# Altium schematic sheet Superbot_USB.SchDoc
size A4
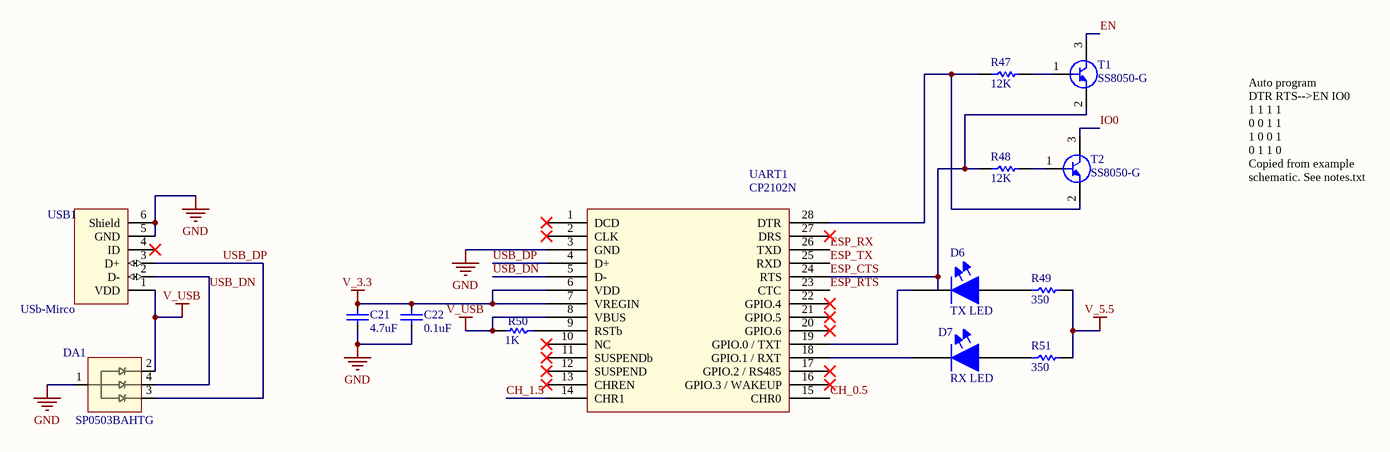
[diagram p0: Superbot_USB.SchDoc]

## Parts
C21  4.7uF  [CAP0603R]
C22  0.1uF  [CAP0603R]
D6  TX LED  [0603_LED]
D7  RX LED  [0603_LED]
DA1  SP0503BAHTG  [SOT143_SP0503BAHT]
R47  12K  [RES0603R]
R48  12K  [RES0603R]
R49  350  [RES0603R]
R50  1K  [RES0603R]
R51  350  [RES0603R]
T1  SS8050-G  [SOT23-SS8050-G]
T2  SS8050-G  [SOT23-SS8050-G]
UART1  CP2102N  [QFN28_CP2102n]
USB1  USb-Mirco  [USB_micro_through]

## Nets
GND: C21.2 C22.2 DA1.1(GND) UART1.3(GND) USB1.5(GND) USB1.6(Shield)
V_3.3: C21.1 C22.1 UART1.6(VDD) UART1.7(VREGIN)
V_5.5: R49.2 R51.2
V_USB: DA1.2(A) R50.2 UART1.8(VBUS) USB1.1(VDD)
CH_0.5: UART1.15(CHR0)
CH_1.5: UART1.14(CHR1)
EN: T1.3(CLCTR)
ESP_CTS: R48.1 T1.2(EMTTR) UART1.24(RTS)
ESP_RTS: UART1.23(CTC)
ESP_RX: UART1.26(TXD)
ESP_TX: UART1.25(RXD)
IO0: T2.3(CLCTR)
USB_DN: DA1.4(C) UART1.5(D-) USB1.2(D-)
USB_DP: DA1.3(B) UART1.4(D+) USB1.3(D+)
NetD6_A: D6.A(ANODE) R49.1
NetD6_K: D6.K(CATHODE) UART1.19(GPIO.0_/_TXT)
NetD7_A: D7.A(ANODE) R51.1
NetD7_K: D7.K(CATHODE) UART1.18(GPIO.1_/_RXT)
NetR47_1: R47.1 T2.2(EMTTR) UART1.28(DTR)
NetR47_2: R47.2 T1.1(BASE)
NetR48_2: R48.2 T2.1(BASE)
NetR50_1: R50.1 UART1.9(RSTb)

Not connected (* = marked no-connect by the designer): UART1 1(DCD)* 2(CLK)* 10(NC)* 11(SUSPENDb)* 12(SUSPEND)* 13(CHREN)* 16(GPIO.3_/_WAKEUP)* 17(GPIO.2_/_RS485)* 20(GPIO.6)* 21(GPIO.5)* 22(GPIO.4)* 27(DRS)*; USB1 4(ID)*

## Notes on the sheet
- Auto program
  DTR RTS-->EN IO0
  1 1 1 1
  0 0 1 1
  1 0 0 1
  0 1 1 0
  Copied from example schematic. See notes.txt

## Library data of the parts
C21 C22 = C: Capacitor; Manufacturer: Microchip Technology; Manufacturer Part Num: MIC5378YC5-TR; Class I: Passive; Revision: July-2002: Re-released for DXP Platform.; Supplier 1: Digikey; Supplier Part Number 1: *; Supplier Part Number 1: 1611-MIC5378YC5-CT-ND
  C21: Value: 4.7uF
  C22: Value: 0.1uF
D6 D7 = LED: Color: RED; Supplier 1: Digikey
DA1 = SP0503BAHTG: TVS DIODE 5.5VWM 8.5VC SOT143; Manufacturer: Littelfuse; Value: *; Manufacturer Part Num: SP0503BAHTG; Supplier 1: Digikey; Supplier Part Number 1: F2715CT-ND
R47-R51 = R: Resistor; Supplier 1: Digikey; Supplier Part Number 1: *
  R47 R48: Value: 12K
  R49 R51: Value: 350
  R50: Value: 1K
T1 T2 = NPN Transistor
UART1 = CP2102N: 336-3694-ND / , IC BRIDGE USB TO UART 28QFN
USB1 = USb-Mirco: USb-Mirco, CONN RCPT MCR USB B SMD TH SHLL; Manufacturer Part Num: ZX62D-B-5P8; Manufacturer: Hirose; Value: *; Supplier 1: Digikey